# Altium schematic sheet OBD-2 ESP32 Shield.SchDoc
size A4; SheetNumber: 1; SheetTotal: 1
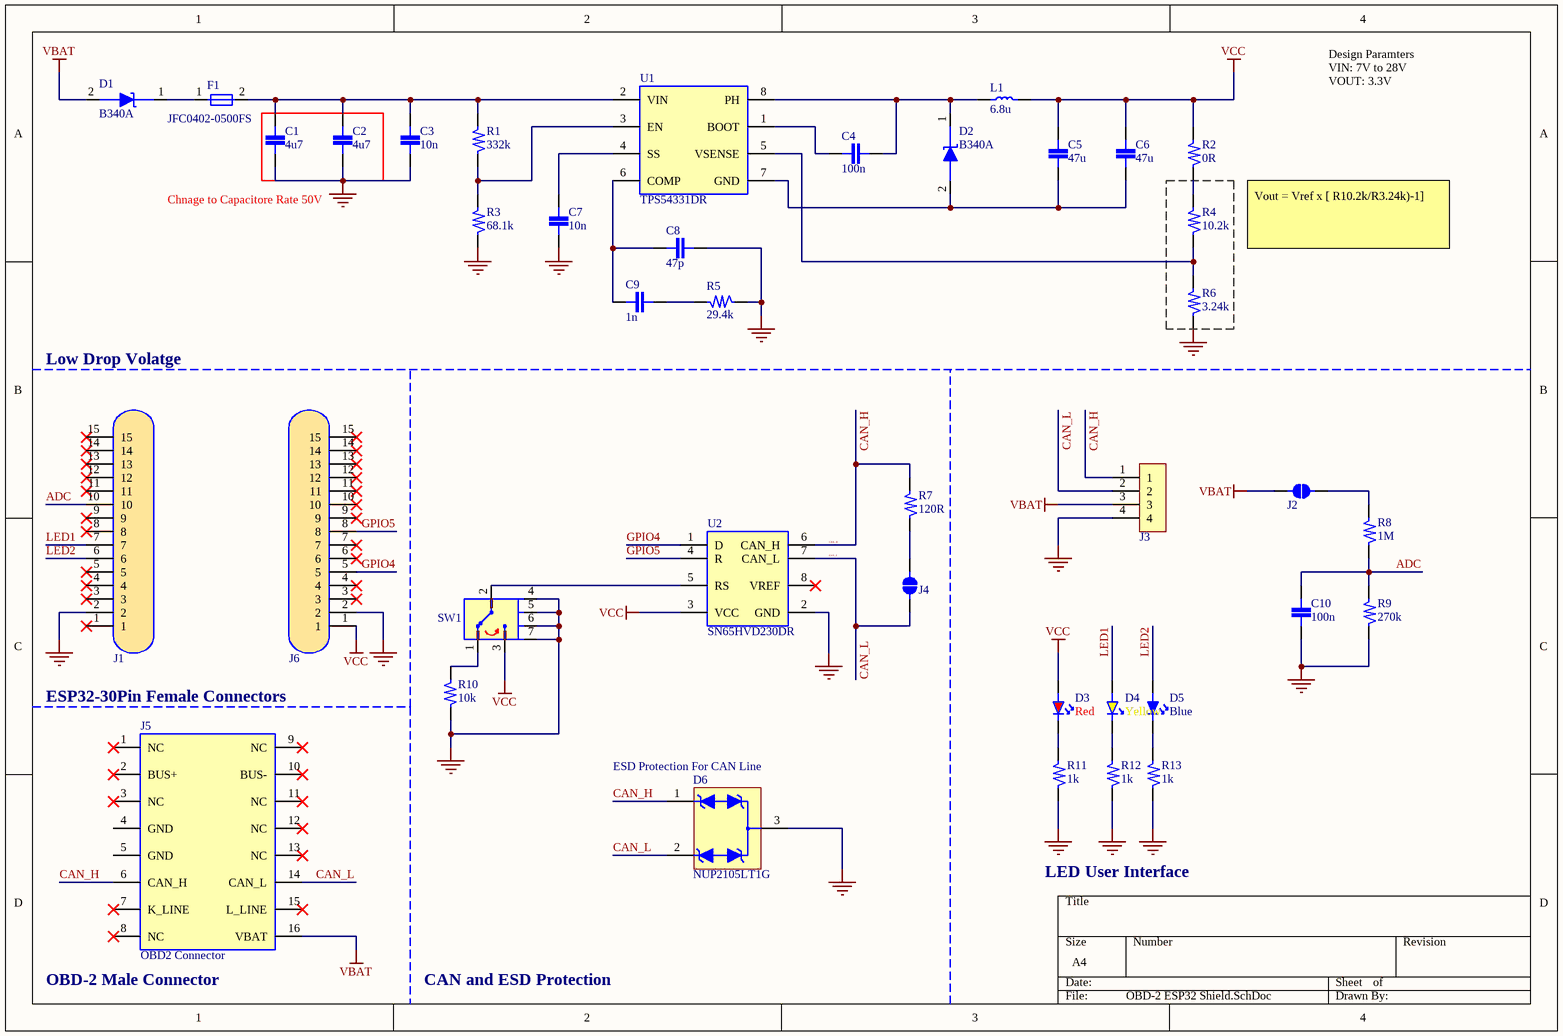
[diagram p0: OBD-2 ESP32 Shield.SchDoc]

## Parts
C1  value 4u7  [CAP0402_1005]  (hidden comment: GRM155R61E475ME15D)
C2  value 4u7  [CAP0402_1005]  (hidden comment: GRM155R61E475ME15D)
C3  value 10n  [CAP0402_1005]  (hidden comment: GRM155R71E103KA01D)
C4  value 100n  [CAP0402_1005]  (hidden comment: GRM155R62A104KE14D)
C5  value 47u  [RES0603_1608]  (hidden comment: GRM188R60J476ME15D)
C6  value 47u  [RES0603_1608]  (hidden comment: GRM188R60J476ME15D)
C7  value 10n  [CAP0402_1005]  (hidden comment: GRM155R71E103KA01D)
C8  value 47p  [CAP0201_0603]  (hidden comment: CC0201KRX7R9BB470)
C9  value 1n  [CAP0402_1005]  (hidden comment: GCM155L81H102KA37D)
C10  value 100n  [CAP0402_1005]  (hidden comment: GRM155R62A104KE14D)
D1  B340A  [SMA(DO-214AC)]
D2  B340A  [SMA(DO-214AC)]
D3  value Red  [LED0603]  (hidden comment: XL-TD1608SURC)
D4  value Yellow  [LED0603]  (hidden comment: XL-TD1608UYC)
D5  value Blue  [LED0603]  (hidden comment: XL-TD1608UBC)
D6  NUP2105LT1G  [SOT-23]
F1  JFC0402-0500FS  [Fuse SMD 0402]
J1  Conn 1x15, 2.45mm  [1-Row, 15-Position, 2.54mm]  (value not drawn)  (net tie, no BOM)
J2  Jumper  [JP0603]  (value not drawn)  (net tie, no BOM)
J3  HCZZ0139-4  [Connector Push-Pull, 2.54mm]  (value not drawn)
J4  Jumper  [JP0603]  (value not drawn)  (net tie, no BOM)
J5  OBD2 Connector  [COMTECH_C-OBD-II-16M]
J6  Conn 1x15, 2.45mm  [1-Row, 15-Position, 2.54mm]  (value not drawn)  (net tie, no BOM)
L1  value 6.8u  [SMD,5.8x5.2mm]  (hidden comment: CY54-6.8UH)
R1  value 332k  [RES0402_1005]  (hidden comment: RC0402FR-07332KL)
R2  value 0R  [RES0402_1005]  (hidden comment: PA0402-R-070RL)
R3  value 68.1k  [RES0402_1005]  (hidden comment: RC0402FR-0768K1L)
R4  value 10.2k  [RES0402_1005]  (hidden comment: RT0402BRD0710K2L)
R5  value 29.4k  [RES0402_1005]  (hidden comment: AT0402DRD0729K4L)
R6  value 3.24k  [RES0402_1005]  (hidden comment: AT0402DRD073K24L)
R7  value 120R  [RES0402_1005]  (hidden comment: RT0402FRE07120RL)
R8  value 1M  [RES0402_1005]  (hidden comment: RC0402JR-071ML)
R9  value 270k  [RES0402_1005]  (hidden comment: RC0402FR-07270KL)
R10  value 10k  [RES0402_1005]  (hidden comment: RT0402DRD0710KL)
R11  value 1k  [RES0402_1005]  (hidden comment: RT0402BRE071KL)
R12  value 1k  [RES0402_1005]  (hidden comment: RT0402BRE071KL)
R13  value 1k  [RES0402_1005]  (hidden comment: RT0402BRE071KL)
SW1  SSSS811101  [SMD-Switch]  (value not drawn)
U1  TPS54331DR  [SOIC-8]
U2  SN65HVD230DR  [SOIC-8]

## Nets
GND: C1.1 C2.1 C3.1 C7.1 C8.1 C10.1 D6.3(A) J1.2 J3.4 J6.2 R3.1 R5.1 R6.1 R9.1 R10.2 R11.1 R12.1 R13.1 SW1.4 SW1.5 SW1.6 SW1.7 U2.2(GND)
VBAT: D1.2(anode) J2.1 J3.3 J5.16(VBAT)
VCC: C5.2 C6.2 D3.1 J6.1 L1.2 R2.2 SW1.3 U2.3(VCC)
ADC: C10.2 J1.10 R8.1 R9.2
CAN_H: D6.1(C) J3.1 J5.6(CAN_H) R7.2 U2.6(CAN_H)
CAN_L: D6.2(C) J3.2 J4.1 J5.14(CAN_L) U2.7(CAN_L)
GPIO4: J6.5 U2.1(D)
GPIO5: J6.8 U2.4(R)
LED1: D4.1 J1.7
LED2: D5.1 J1.6
NetC1_2: C1.2 C2.2 C3.2 F1.2 R1.2 U1.2(VIN)
NetC4_1: C4.1 U1.1(BOOT)
NetC4_2: C4.2 D2.1(cathode) L1.1 U1.8(PH)
NetC5_1: C5.1 C6.1 D2.2(anode) U1.7(GND)
NetC7_2: C7.2 U1.4(SS)
NetC8_2: C8.2 C9.2 U1.6(COMP)
NetC9_1: C9.1 R5.2
NetD1_1: D1.1(cathode) F1.1
NetD3_2: D3.2 R11.2
NetD4_2: D4.2 R12.2
NetD5_2: D5.2 R13.2
NetJ2_2: J2.2 R8.2
NetJ4_2: J4.2 R7.1
NetR1_1: R1.1 R3.2 U1.3(EN)
NetR2_1: R2.1 R4.2
NetR4_1: R4.1 R6.2 U1.5(VSENSE)
NetR10_1: R10.1 SW1.1
NetSW1_2: SW1.2 U2.5(RS)

Not connected (* = marked no-connect by the designer): J1 1* 3* 4* 5* 8* 9* 11* 12* 13* 14* 15*; J5 1(NC)* 2(BUS+)* 3(NC)* 4(GND) 5(GND) 7(K_LINE)* 8(NC)* 9(NC)* 10(BUS-)* 11(NC)* 12(NC)* 13(NC)* 15(L_LINE)*; J6 3* 4* 6* 7* 9* 10* 11* 12* 13* 14* 15*; U2 8(VREF)*

## Notes on the sheet
- Chnage to Capacitore Rate 50V
- Vout = Vref x [ R10.2k/R3.24k)-1]
- Design Paramters
  VIN: 7V to 28V
  VOUT: 3.3V
- Low Drop Volatge
- ESP32-30Pin Female Connectors
- (near D6) ESD Protection For CAN Line
- LED User Interface
- (near J5) OBD-2 Male Connector
- CAN and ESD Protection

## Library data of the parts
C1 C2 = GRM155R61E475ME15D: 25V 4.7uF X5R 0402 Multilayer Ceramic Capacitors MLCC - SMD/SMT ROHS; Mfr Name: Murata Electronics; LCSC Part #: C2858031; Mfr.Part #: GRM155R61E475ME15D
C3 C7 = GRM155R71E103KA01D: 25V 10nF X7R ±10% 0402 Multilayer Ceramic Capacitors MLCC - SMD/SMT ROHS; Mfr Name: Murata Electronics; LCSC Part #: C77013; Mfr. Part #: GRM155R71E103KA01D
C4 C10 = GRM155R62A104KE14D: 100V 100nF X5R ±10% 0402 Multilayer Ceramic Capacitors MLCC - SMD/SMT ROHS; Mfr Name: Murata Electronics; LCSC Part #: C162178; Mfr. Part #: GRM155R62A104KE14D
C5 C6 = GRM188R60J476ME15D: 6.3V 47uF X5R ±20% 0603 Multilayer Ceramic Capacitors MLCC - SMD/SMT ROHS; Mfr Name: Murata Electronics; LCSC Part #: C140782; Mfr. Part #: GRM188R60J476ME15D
C8 = CC0201KRX7R9BB470: 50V 47pF X7R ±10% 0201 Multilayer Ceramic Capacitors MLCC - SMD/SMT ROHS; Mfr Name: YAGEO; LCSC Part #: C576697; Mfr. Part #: CC0201KRX7R9BB470
C9 = GCM155L81H102KA37D: 50V 1nF X8L ±10% 0402 Multilayer Ceramic Capacitors MLCC - SMD/SMT ROHS; Mfr Name: Murata Electronics; Mfr. Part #: GCM155L81H102KA37D; LCSC Part #: C701290
D1 D2 = B340A: 40V 3A 550mV@3A SMA(DO-214AC) Schottky Barrier Diodes (SBD) ROHS; LCSC Part #: C3018525; Mfr.Part #: B340A
D3 = XL-TD1608SURC: 5mA 无色透明透镜 620nm~625nm -30℃~+85℃ Positive post Red 30° 77.5mW 0603 Light Emitting Diodes (LED) ROHS; Mfr Name: XINGLIGHT; LCSC Part #: C965849; Mfr. Part #: XL-TD1608SURC
D4 = XL-TD1608UYC: 5mA 无色透明透镜 -30℃~+85℃ Positive post 586nm~590nm Yellow 30° 77.5mW 0603 Light Emitting Diodes (LED) ROHS; Mfr Name: XINGLIGHT; LCSC Part #: C965850; Mfr. Part #: XL-TD1608UYC
D5 = XL-TD1608UBC: 5mA 无色透明透镜 -30℃~+85℃ Positive post 466nm~472nm Blue 30° 77.5mW 0603 Light Emitting Diodes (LED) ROHS; Mfr Name: XINGLIGHT; LCSC Part #: C965853; Mfr. Part #: XL-TD1608UBC
D6 = NUP2105LT1G: SOT-23 Electrostatic and Surge Protection (TVS/ESD) ROHS; LCSC Part #: C2890118; Mfr.Part #: NUP2105LT1G
F1 = JFC0402-0500FS: 35A SMD Fuse 500mA 32V 32V 0402 Fuses ROHS; Mfr Name #: Shenzhen JDT; LCSC Part #: C136320; Mfr.Part #: JFC0402-0500FS
J1 J6 = Header Connector 1x15, 2.54mm: Value: Conn 1x15, 2.54mm
J2 J4 = Jumper: Jumer 0604
J3 = HCZZ0139-4: Connector Push-Pull, 4PIN, 2.5mm; Mfr Name: Hong Cheng; LCSC Part #: C7433739; Mfr. Part #: HCZZ0139-4
J5 = OBD2 Connector: 16Pin, 2Row, 3.2mm, 4mm
L1 = CY54-6.8UH: 2.4A 6.8uH ±20% 58.5mΩ SMD,5.8x5.2mm Inductors (SMD) ROHS; Mfr Name: SHOU HAN; LCSC Part #: C2929430; Mfr. Part #: CY54-6.8UH
R1 = RC0402FR-07332KL: 62.5mW Thick Film Resistors 50V ±100ppm/℃ ±1% 332kΩ 0402 Chip Resistor - Surface Mount ROHS; Mfr Name: YAGEO; LCSC Part #: C138005; Mfr.Part #: RC0402FR-07332KL
R2 = PA0402-R-070RL: 62.5mW ±150ppm/℃ 0Ω 0402 Chip Resistor - Surface Mount ROHS; Mfr Name: YAGEO; LCSC Part #: C4044221; Mfr. Part #: PA0402-R-070RL
R3 = RC0402FR-0768K1L: 62.5mW Thick Film Resistors 50V ±100ppm/℃ ±1% 68.1kΩ 0402 Chip Resistor - Surface Mount ROHS; Mfr Name: YAGEO; LCSC Part #: C276276; Mfr.Part #: RC0402FR-0768K1L
R4 = RT0402BRD0710K2L: 62.5mW Thin Film Resistor 50V ±25ppm/℃ ±0.1% 10.2kΩ 0402 Chip Resistor - Surface Mount ROHS; Mfr Name: YAGEO; LCSC Part #: C852479; Mfr. Part #: RT0402BRD0710K2L
R5 = AT0402DRD0729K4L: 63mW Thin Film Resistor ±0.5% ±25ppm/℃ 29.4kΩ 0402 Chip Resistor - Surface Mount ROHS; Mfr Name: YAGEO; LCSC Part #: C851325; Mfr. Part #: AT0402DRD0729K4L
R6 = AT0402DRD073K24L: 63mW Thin Film Resistor ±0.5% ±25ppm/℃ 3.24kΩ 0402 Chip Resistor - Surface Mount ROHS; Mfr Name: YAGEO; LCSC Part #: C851383; Mfr. Part #: AT0402DRD073K24L
R7 = RT0402FRE07120RL: 62.5mW Thin Film Resistor ±50ppm/℃ ±1% 120Ω 0402 Chip Resistor - Surface Mount ROHS; Mfr Name: YAGEO; LCSC Part #: C854098; Mfr. Part #: RT0402FRE07120RL
R8 = RC0402JR-071ML: 62.5mW Thick Film Resistors 50V ±100ppm/℃ ±5% 1MΩ 0402 Chip Resistor - Surface Mount ROHS; Mfr Name: YAGEO; LCSC Part #: C93949; Mfr. Part #: RC0402JR-071ML
R9 = RC0402FR-07270KL: 62.5mW Thick Film Resistors 50V ±100ppm/℃ ±1% 270kΩ 0402 Chip Resistor - Surface Mount ROHS; Mfr Name: YAGEO; LCSC Part #: C163475; Mfr. Part #: RC0402FR-07270KL
R10 = RT0402DRD0710KL: 62.5mW Thin Film Resistor ±0.5% ±25ppm/℃ 10kΩ 0402 Chip Resistor - Surface Mount ROHS; Mfr Name: YAGEO; LCSC Part #: C853514; Mfr. Part #: RT0402DRD0710KL
R11-R13 = RT0402BRE071KL: 62.5mW Thin Film Resistor 50V ±50ppm/℃ ±0.1% 1kΩ 0402 Chip Resistor - Surface Mount ROHS; Mfr Name: YAGEO; LCSC Part #: C513664; Mfr. Part #: RT0402BRE071KL
SW1 = SSSS811101: 300mA Surface Mount，Right Angle SPDT 5V 1万次 SMD Slide Switches ROHS; LCSC Part #: C109335; Mfr.Part #: SSSS811101
U1 = TPS54331DR: Step-down type Adjustable 800mV~25V 3A 3.5V~28V SOIC-8 DC-DC Converters ROHS; LCSC Part #: C9865; Mfr.Part #: TPS54331DR
U2 = SN65HVD230DR: 1Mbps Transceiver SOIC-8 CAN ICs ROHS; LCSC Part #: C12084; Mfr.Part #: SN65HVD230DR